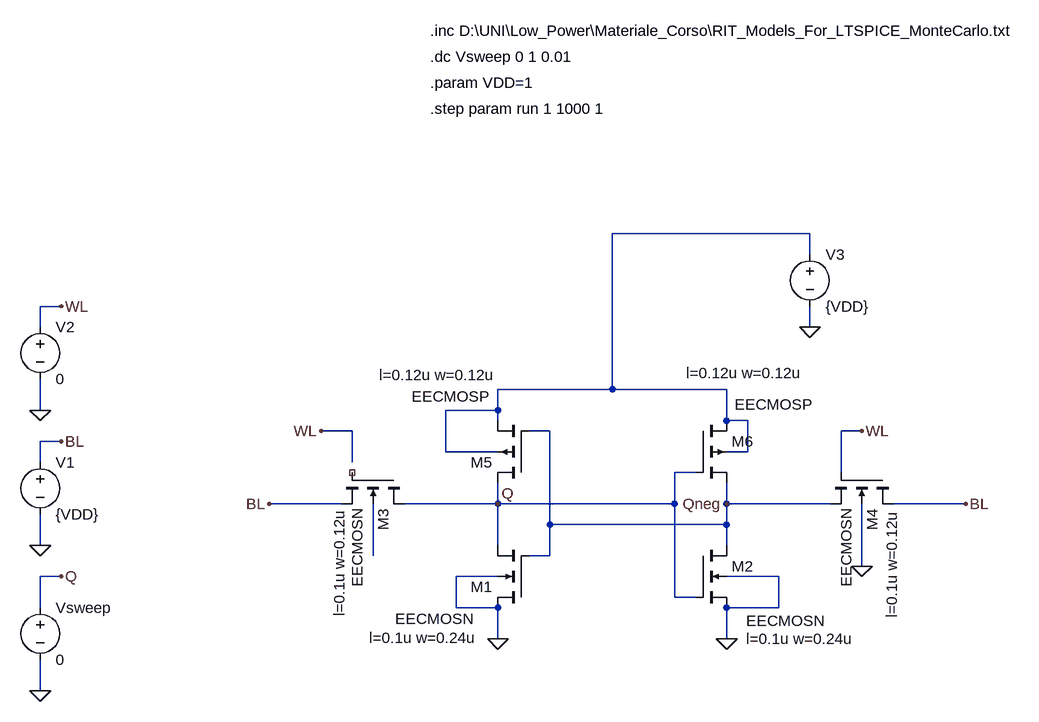
[diagram p0: schematic Draft4.asc]
Draft4.asc, the LTspice schematic file:
Version 4
SHEET 1 1192 1348
WIRE 752 288 448 288
WIRE 752 320 752 288
WIRE -400 400 -432 400
WIRE -432 432 -432 400
WIRE 752 432 752 400
WIRE 448 528 448 288
WIRE 448 528 272 528
WIRE 624 528 448 528
WIRE -432 560 -432 512
WIRE 272 560 272 528
WIRE 272 560 192 560
WIRE 272 576 272 560
WIRE 624 576 624 528
WIRE 656 576 624 576
WIRE 48 592 0 592
WIRE 352 592 320 592
WIRE 832 592 800 592
WIRE -400 608 -432 608
WIRE 192 624 192 560
WIRE 272 624 192 624
WIRE 656 624 656 576
WIRE 656 624 624 624
WIRE -432 640 -432 608
WIRE 48 640 48 592
WIRE 576 656 544 656
WIRE 800 656 800 592
WIRE 32 704 -80 704
WIRE 272 704 272 672
WIRE 272 704 128 704
WIRE 544 704 544 656
WIRE 544 704 272 704
WIRE 624 704 624 672
WIRE 784 704 624 704
WIRE 992 704 880 704
WIRE 352 736 352 592
WIRE 624 736 624 704
WIRE 624 736 352 736
WIRE -432 768 -432 720
WIRE 272 768 272 704
WIRE 624 768 624 736
WIRE 80 784 80 704
WIRE 352 784 352 736
WIRE 352 784 320 784
WIRE 832 800 832 704
WIRE -400 816 -432 816
WIRE 272 816 208 816
WIRE 704 816 624 816
WIRE 544 848 544 704
WIRE 576 848 544 848
WIRE -432 864 -432 816
WIRE 208 864 208 816
WIRE 272 864 208 864
WIRE 704 864 704 816
WIRE 704 864 624 864
WIRE 272 912 272 864
WIRE 624 912 624 864
WIRE -432 992 -432 944
FLAG -432 768 0
FLAG -432 992 0
FLAG 272 912 0
FLAG 624 912 0
FLAG 832 800 0
FLAG 752 432 0
FLAG -400 816 Q
FLAG 272 704 Q
FLAG 624 704 Qneg
FLAG -80 704 BL
FLAG 832 592 WL
FLAG 992 704 BL
FLAG -400 608 BL
FLAG -432 560 0
FLAG -400 400 WL
FLAG 0 592 WL
SYMBOL nmos4 320 864 R180
WINDOW 3 85 -17 Left 2
WINDOW 123 80 -46 Left 2
SYMATTR Value EECMOSN
SYMATTR Value2 l=0.1u w=0.24u
SYMATTR InstName M1
SYMBOL nmos4 576 768 R0
WINDOW 3 78 116 Left 2
WINDOW 123 78 144 Left 2
SYMATTR Value EECMOSN
SYMATTR Value2 l=0.1u w=0.24u
SYMATTR InstName M2
SYMBOL nmos4 128 656 R90
WINDOW 123 56 100 Left 2
SYMATTR Value2 l=0.1u w=0.12u
SYMATTR InstName M3
SYMATTR Value EECMOSN
SYMBOL nmos4 880 656 R90
WINDOW 123 58 2 Left 2
SYMATTR Value2 l=0.1u w=0.12u
SYMATTR InstName M4
SYMATTR Value EECMOSN
SYMBOL pmos4 320 672 R180
WINDOW 3 61 133 Left 2
WINDOW 123 51 166 Left 2
SYMATTR Value EECMOSP
SYMATTR Value2 l=0.12u w=0.12u
SYMATTR InstName M5
SYMBOL pmos4 576 576 R0
WINDOW 3 60 -25 Left 2
WINDOW 123 -14 -73 Left 2
SYMATTR Value EECMOSP
SYMATTR Value2 l=0.12u w=0.12u
SYMATTR InstName M6
SYMBOL voltage -432 624 R0
WINDOW 123 0 0 Left 0
WINDOW 39 0 0 Left 0
SYMATTR InstName V1
SYMATTR Value {VDD}
SYMBOL voltage -432 848 R0
SYMATTR InstName Vsweep
SYMATTR Value 0
SYMBOL voltage 752 304 R0
SYMATTR InstName V3
SYMATTR Value {VDD}
SYMBOL voltage -432 416 R0
WINDOW 123 0 0 Left 0
WINDOW 39 0 0 Left 0
SYMATTR InstName V2
SYMATTR Value 0
TEXT 168 16 Left 2 !.dc Vsweep 0 1 0.01
TEXT 168 -24 Left 2 !.inc D:\\UNI\\Low_Power\\Materiale_Corso\\RIT_Models_For_LTSPICE_MonteCarlo.txt
TEXT 168 56 Left 2 !.param VDD=1
TEXT 168 96 Left 2 !.step param run 1 1000 1

The netlist it stands for:
* Draft4.asc
M1 0 Qneg Q 0 EECMOSN l=0.1u w=0.24u
M2 Qneg Q 0 0 EECMOSN l=0.1u w=0.24u
M3 Q NC_01 BL N002 EECMOSN l=0.1u w=0.12u
M4 BL WL Qneg 0 EECMOSN l=0.1u w=0.12u
M5 Q Qneg N001 N001 EECMOSP l=0.12u w=0.12u
M6 N001 Q Qneg N001 EECMOSP l=0.12u w=0.12u
V1 BL 0 {VDD}
Vsweep Q 0 0
V3 N001 0 {VDD}
V2 WL 0 0
.model NMOS NMOS
.model PMOS PMOS
.lib standard.mos
.dc Vsweep 0 1 0.01
.inc D:\UNI\Low_Power\Materiale_Corso\RIT_Models_For_LTSPICE_MonteCarlo.txt
.param VDD=1
.step param run 1 1000 1
.backanno
.end